# Altium schematic sheet ControlledCharger.SchDoc
size 420 x 297 mm; DocumentNumber: ControlledCharger
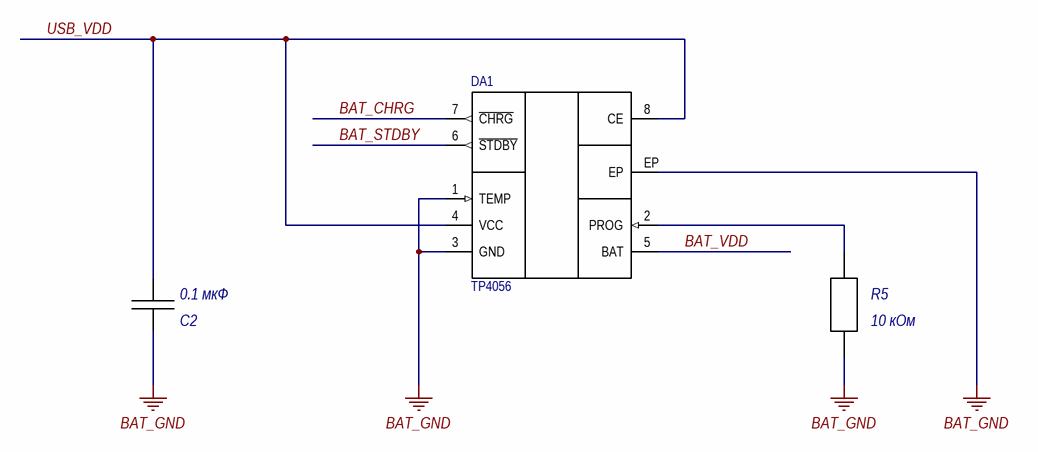
[diagram p0: ControlledCharger.SchDoc]

## Parts
C2  0.1 мкФ  [C 0805]
DA1  TP4056  [HSOP-8]
R5  10 кОм  [RES 0402]

## Nets
BAT_GND: C2.2 DA1.1(TEMP) DA1.3(GND) DA1.EP R5.1
BAT_CHRG: DA1.7(~{CHRG})
BAT_STDBY: DA1.6(~{STDBY})
BAT_VDD: DA1.5(BAT)
USB_VDD: C2.1 DA1.4(VCC) DA1.8(CE)
NetDA1_2: DA1.2(PROG) R5.2

## Notes on the sheet
- Подп. и дата
- Инв. № дубл.
- Взам. инв. №
- Инв. № подл.
- Лист
- Изм.
- № докум.
- Подп.
- Дата
- Копировал
- Формат А3

## Library data of the parts
C2 = CAP 0805: SMD Capacitor 0805; Manufacturer: /Укажите компанию-производителя/; Tolerance: /Укажите допуск в процентах/; Temperature coefficient: /Формат: ±? ppm/°C/; Type: Конденсатор керамический; TC: /Укажите тип диэлектрика/; Size: 0805; Temperature range: /Формат: -? ... ? °C/
R5 = RES 0402